# Altium schematic sheet FIT_TCM_SI5338A.SchDoc: FIT_PM12 board
size 420 x 297 mm; CheckedBy: G.Kasprowicz; Author: INR Moscow; CompanyName: WUT ISE; DrawnBy: M.Podgórski; Organization: WUT ISE; Address1: PW ISE; Address2: Nowowiejska 15/19 00-665 Warsaw; Address3: gkasprow@gmail.com; Revision: 2; SheetNumber: -; SheetTotal: -; ModifiedBy: -; CheckedDate: -; Title2: Title 2; DivGrp: WUT ISE; Designer: INR RAS; ModifiedDate: -; ProjectName: Sensor Box
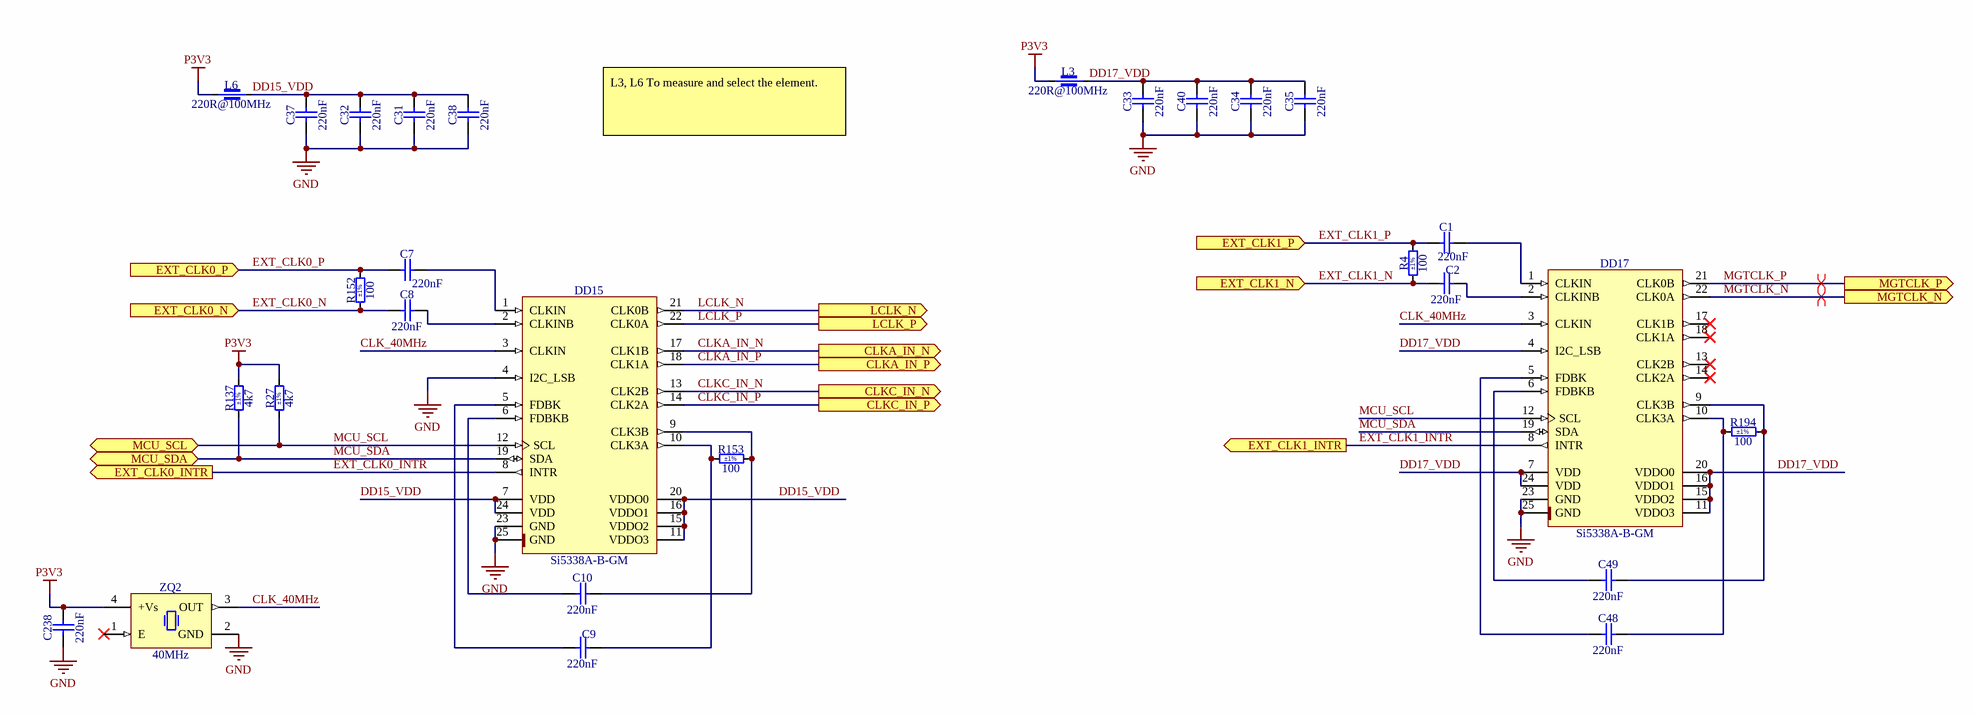
[diagram p0: FIT_TCM_SI5338A.SchDoc]

## Parts
C1  220nF  [CAPC1608X87N]
C2  220nF  [CAPC1608X87N]
C7  220nF  [CAPC1608X87N]
C8  220nF  [CAPC1608X87N]
C9  220nF  [CAPC1608X87N]
C10  220nF  [CAPC1608X87N]
C31  220nF  [CAPC2012X135N]
C32  220nF  [CAPC2012X135N]
C33  220nF  [CAPC2012X135N]
C34  220nF  [CAPC2012X135N]
C35  220nF  [CAPC2012X135N]
C37  220nF  [CAPC2012X135N]
C38  220nF  [CAPC2012X135N]
C40  220nF  [CAPC2012X135N]
C48  220nF  [CAPC1608X87N]
C49  220nF  [CAPC1608X87N]
C238  220nF  [CAPC2012X135N]
DD15  Si5338A-B-GM  [QFN50P400X400X90-25N-S265]
DD17  Si5338A-B-GM  [QFN50P400X400X90-25N-S265]
L3  220R@100MHz  [INDC2012X105N]
L6  220R@100MHz  [INDC2012X105N]
R4  100  Tolerance: ±1%  [RESC1608X55N]
R27  4k7  Tolerance: ±1%  [RESC2012X60N]
R137  4k7  Tolerance: ±1%  [RESC2012X60N]
R152  100  Tolerance: ±1%  [RESC1608X55N]
R153  100  Tolerance: ±1%  [RESC1608X55N]
R194  100  Tolerance: ±1%  [RESC1608X55N]
ZQ2  40MHz  [OSC_IQD_CFPS-73]

## Ports
CLKA_IN_N (out), CLKA_IN_P (out), CLKC_IN_N (out), CLKC_IN_P (out), EXT_CLK0_INTR (out), EXT_CLK0_N (in), EXT_CLK0_P (in), EXT_CLK1_INTR (out), EXT_CLK1_N (in), EXT_CLK1_P (in), LCLK_N (out), LCLK_P (out), MCU_SCL (bidir), MCU_SDA (bidir), MGTCLK_N (out), MGTCLK_P (out)

## Nets
GND: C31.1 C32.1 C33.1 C34.1 C35.1 C37.1 C38.1 C40.1 C238.1 DD15.4(I2C_LSB) DD15.23(GND) DD15.25(GND) DD17.23(GND) DD17.25(GND) ZQ2.2(GND)
P3V3: C238.2 L3.1 L6.1 R27.2 R137.2 ZQ2.4(+Vs)
CLK_40MHz: DD15.3(CLKIN) DD17.3(CLKIN) ZQ2.3(OUT)
CLKA_IN_N: DD15.17(CLK1B) ; port CLKA_IN_N
CLKA_IN_P: DD15.18(CLK1A) ; port CLKA_IN_P
CLKC_IN_N: DD15.13(CLK2B) ; port CLKC_IN_N
CLKC_IN_P: DD15.14(CLK2A) ; port CLKC_IN_P
DD15_VDD: C31.2 C32.2 C37.2 C38.2 DD15.7(VDD) DD15.11(VDDO3) DD15.15(VDDO2) DD15.16(VDDO1) DD15.20(VDDO0) DD15.24(VDD) L6.2
DD17_VDD: C33.2 C34.2 C35.2 C40.2 DD17.4(I2C_LSB) DD17.7(VDD) DD17.11(VDDO3) DD17.15(VDDO2) DD17.16(VDDO1) DD17.20(VDDO0) DD17.24(VDD) L3.2
EXT_CLK0_INTR: DD15.8(INTR) ; port EXT_CLK0_INTR
EXT_CLK0_N: C8.1 R152.1 ; port EXT_CLK0_N
EXT_CLK0_P: C7.1 R152.2 ; port EXT_CLK0_P
EXT_CLK1_INTR: DD17.8(INTR) ; port EXT_CLK1_INTR
EXT_CLK1_N: C2.1 R4.1 ; port EXT_CLK1_N
EXT_CLK1_P: C1.1 R4.2 ; port EXT_CLK1_P
LCLK_N: DD15.21(CLK0B) ; port LCLK_N
LCLK_P: DD15.22(CLK0A) ; port LCLK_P
MCU_SCL: DD15.12(SCL) DD17.12(SCL) R27.1 ; port MCU_SCL
MCU_SDA: DD15.19(SDA) DD17.19(SDA) R137.1 ; port MCU_SDA
MGTCLK_N: DD17.22(CLK0A) ; port MGTCLK_N
MGTCLK_P: DD17.21(CLK0B) ; port MGTCLK_P
NetC1_2: C1.2 DD17.1(CLKIN)
NetC2_2: C2.2 DD17.2(CLKINB)
NetC7_2: C7.2 DD15.1(CLKIN)
NetC8_2: C8.2 DD15.2(CLKINB)
NetC9_1: C9.1 DD15.5(FDBK)
NetC9_2: C9.2 DD15.10(CLK3A) R153.1
NetC10_1: C10.1 DD15.6(FDBKB)
NetC10_2: C10.2 DD15.9(CLK3B) R153.2
NetC48_1: C48.1 DD17.5(FDBK)
NetC48_2: C48.2 DD17.10(CLK3A) R194.1
NetC49_1: C49.1 DD17.6(FDBKB)
NetC49_2: C49.2 DD17.9(CLK3B) R194.2

Not connected (* = marked no-connect by the designer): DD17 13(CLK2B)* 14(CLK2A)* 17(CLK1B)* 18(CLK1A)*; ZQ2 1(E)*

## Layout directives
differential pair: MGTCLK_N, MGTCLK_P

## Notes on the sheet
- L3, L6 To measure and select the element.
- Project/Equipment
- Document
- Designer
- Drawn by
- Check.by
- Copyright WUT ISE 2024.
  This documentation describes Open Hardware and is licensed under the CERN OHL v.2. You may redistribute and modify this documentation under the terms of the CERN OHL v.2. (http://ohwr.org/CERNOHL). This documentation is distributed WITHOUT ANY EXPRESS OR IMPLIED WARRANTY, INCLUDING OF MERCHANTABILITY, SATISFACTORY QUALITY AND FITNESS FOR A PARTICULAR PURPOSE. Please see the CERN OHL v.2 for applicable conditions.
- Contact
- File
- Last Mod.
- Print Date
- Sheet
- Size
- A3
- of
- Rev

## Library data of the parts
C1 C2 C7-C10 C48 C49 = CC0603_220NF_25V_10%_X7R: Non-polarised capacitor; Part Description: SMD Multilayer Chip Ceramic Capacitor; Manufacturer: GENERIC; Manufacturer1 Part Number: C0603C224K3RACTU; Voltage: 25V; TC: X7R; Tolerance: ±10%; Part Number: CC0603_220NF_25V_10%_X7R; Component Kind: Standard; Component Type: Standard; Pin Count: 2; Value: 220nF; Status: Preferred; Manufacturer Part Number: CC0603_220NF_25V_10%_X7R; Case: 0603; Mounted: Yes; Socket: No; SMD: Yes; Sense: No; Manufacturer1 Example: KEMET; Manufacturer1 ComponentHeight: 0.87mm; HelpURL: \\cern.ch\dfs\Applications\Altium\Datasheets\CC0603_X7R_KEMET.pdf; Author: CERN DEM JLC; CreateDate: 29.10.2014; LatestRevisionDate: 29.10.2014
C31-C35 C37 C38 C40 C238 = CC0805_220NF_50V_10%_X7R: Non-polarised capacitor; Part Description: SMD Multilayer Chip Ceramic Capacitor; Manufacturer: GENERIC; Manufacturer1 Part Number: GRM21BR71H224KA01L; Voltage: 50V; TC: X7R; Tolerance: ±10%; Part Number: CC0805_220NF_50V_10%_X7R; Component Kind: Standard; Component Type: Standard; Pin Count: 2; Value: 220nF; Status: Preferred; Manufacturer Part Number: CC0805_220NF_50V_10%_X7R; Case: 0805; Mounted: Yes; Socket: No; SMD: Yes; Sense: No; Manufacturer1 Example: MURATA; Manufacturer1 ComponentHeight: 1.35mm; HelpURL: \\cern.ch\dfs\Applications\Altium\Datasheets\CC0805_X7R_MURATA.pdf; Author: CERN DEM JLC; CreateDate: 03.12.2007; LatestRevisionDate: 03.12.2007
DD15 DD17 = Si5338A-B-GM: I2C-Programmable Any-Frequency, Any-Output Quad Clock Generator; Part Description: 0.16 MHz to 710 MHz I2C_LSB, I2C-Programmable Quad Clock Generator; Manufacturer: SILICON LABS; PressFit: No; Bonding: No; Part Number: Si5338A-B-GM; Component Kind: Standard; Component Type: Standard; Device: Si5338A-B-GM; PackageDescription: QFN, 0.50mm Pitch, Square; 24 Pin, 4.00mm L X 4.00mm W X 0.90mm H body (w/Thermal Tab 2.65 X 2.65mm), IPC Medium Density; Manufacturer Part Number: Si5338A-B-GM; Pin Count: 25; Case: QFN24; Mounted: Yes; Socket: No; SMD: Yes; Sense: No; ComponentHeight: 0.9mm; HelpURL: \\cern.ch\dfs\Applications\Altium\Datasheets\Si5338A-B-GM.pdf; Author: CERN DEM JMW; CreateDate: 07.02.2020; LatestRevisionDate: 07.02.2020
L3 L6 = IND0805_TDK_MPZ2012S221A: Part Description: SMT Chip Bead for General Power Line (MPZ Series); Manufacturer: TDK; Power: 3A; Resistance: 0.04R; Tolerance: ±25%; Part Number: IND0805_TDK_MPZ2012S221A; Component Kind: Standard; Component Type: Standard; Pin Count: 2; Value: 220R@100MHz; Manufacturer Part Number: MPZ2012S221A; Case: 0805; Mounted: Yes; Socket: No; SMD: Yes; Sense: No; ComponentHeight: 1.05mm; HelpURL: \\cern.ch\dfs\Applications\Altium\Datasheets\IND0805_TDK_MPZ2012.pdf; Author: CERN DEM HF; CreateDate: 04.10.2021; LatestRevisionDate: 04.10.2021
R4 R152 R153 R194 = R0603_100R_1%_0.1W_100PPM: Resistor - 1%; Part Description: General Purpose Thick Film Chip Resistor; Manufacturer: GENERIC; Manufacturer1 Part Number: NRC06F4700TRF; Power: 0.1W; TC: ±100ppm/°C; PressFit: No; Part Number: R0603_100R_1%_0.1W_100PPM; Component Kind: Standard; Component Type: Standard; Pin Count: 2; Value: 100; Status: Preferred; Manufacturer Part Number: R0603_100R_1%_0.1W_100PPM; Case: 0603; Mounted: Yes; Sense: No; Socket: No; SMD: Yes; Manufacturer1 Example: NIC COMPONENT; Manufacturer1 ComponentHeight: 0.55mm; HelpURL: \\cern.ch\dfs\Applications\Altium\Datasheets\R0603_NIC_NRC.pdf; Author: CERN DEM JLC; CreateDate: 03.12.2007; LatestRevisionDate: 13.03.2008
R27 R137 = R0805_4K7_1%_0.125W_100PPM: Resistor - 1%; Part Description: General Purpose Thick Film Chip Resistor; Manufacturer: GENERIC; Manufacturer1 Part Number: NRC10F4701TRF; Power: 0.125W; TC: ±100ppm/°C; PressFit: No; Part Number: R0805_4K7_1%_0.125W_100PPM; Component Kind: Standard; Component Type: Standard; Pin Count: 2; Value: 4k7; Status: Preferred; Manufacturer Part Number: R0805_4K7_1%_0.125W_100PPM; Case: 0805; Mounted: Yes; Sense: No; Socket: No; SMD: Yes; Manufacturer1 Example: NIC COMPONENT; Manufacturer1 ComponentHeight: 0.6mm; HelpURL: \\cern.ch\dfs\Applications\Altium\Datasheets\R0805_NIC_NRC.pdf; Author: CERN DEM JLC; CreateDate: 03.12.2007; LatestRevisionDate: 13.03.2008
ZQ2 = OSC_40MHZ_IQD_LFSPXO018042: Oscillator 4 pins 1=E 2=GND 3=OUT 4=+Vs; Part Description: 3.3V, ±50ppm, 50pF, 0..70°C, HCMOS Surface Mount Clock Oscillator (CFPS-73 Series); Manufacturer: IQD FREQUENCY PRODUCTS; PressFit: No; Bonding: No; Part Number: OSC_40MHZ_IQD_LFSPXO018042; Component Kind: Standard; Component Type: Standard; PackageDescription: Oscillator, Side Concave, 5.08mm Pitch, 4 Pins, 5.00mm L X 7.00mm W X 1.40mm H, CFPS-73 Series; Value: 40MHz; Manufacturer Part Number: LFSPXO018042; Pin Count: 4; Mounted: Yes; Socket: No; SMD: Yes; Sense: No; ComponentHeight: 1.4mm; HelpURL: \\cern.ch\dfs\Applications\Altium\Datasheets\OSC_IQD_LFSPXO018042.pdf; Author: CERN DEM JLC; CreateDate: 22.08.2011; LatestRevisionDate: 03.11.2016